# EAGLE schematic audio-pa-250mW-7.2V (EAGLE 5.07)
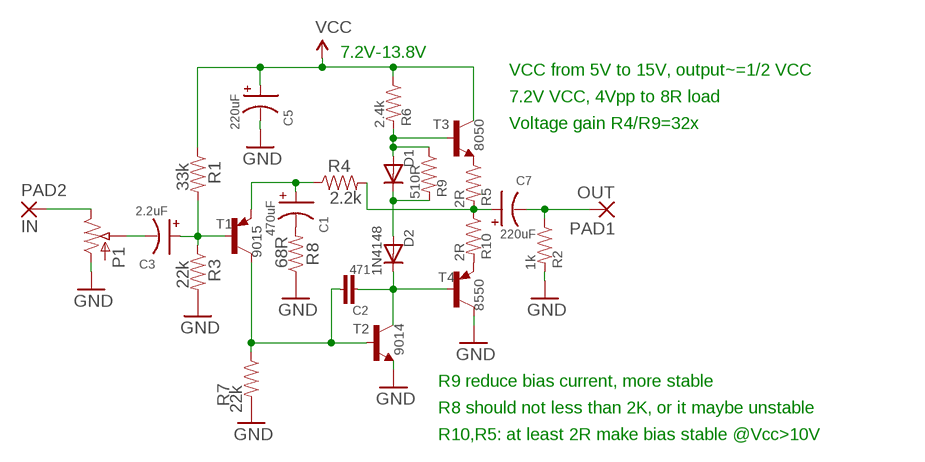
[diagram p0: schematic, sheet 1]

## Parts
C1  470uF  CAP_POLPTH1  [CPOL-RADIAL-100UF-25V]
C2  471  CAP-C0805  [C0805]
C3  2.2uF  CAP_POLPTH1  [CPOL-RADIAL-100UF-25V]
C5  220uF  CAP_POLPTH1  [CPOL-RADIAL-100UF-25V]
C7  220uF  CAP_POLPTH1  [CPOL-RADIAL-100UF-25V]
D1  DIODE1N4148  [DIODE-1N4148]
D2  1N4148  DIODE1N4148  [DIODE-1N4148]
P1  POTA16  [POTA_16]
PAD1  OUT  WIREPAD4,16O1,6  [4,16O1,6]
PAD2  IN  WIREPAD4,16O1,6  [4,16O1,6]
R1  33k  RESISTOR0805  [0805]
R2  1k  RESISTOR0805  [0805]
R3  22k  RESISTOR0805  [0805]
R4  2.2k  RESISTOR0805  [0805]
R5  2R  RESISTOR0805  [0805]
R6  2.4k  RESISTOR0805  [0805]
R7  22k  RESISTOR0805  [0805]
R8  68R  RESISTOR0805  [0805]
R9  510R  RESISTOR0805  [0805]
R10  2R  RESISTOR0805  [0805]
T1  9015  -PNP-TO92-EBC  [TO92-EBC]
T2  9014  -NPN-TO92-EBC  [TO92-EBC]
T3  8050  -NPN-TO92-EBC  [TO92-EBC]
T4  8550  -PNP-TO92-EBC  [TO92-EBC]

## Nets
GND: C5.2(-) P1.SCCW(A) R2.2 R3.2 R7.2 R8.1 T2.E T4.C
N$1: R10.2 T4.E
N$2: C1.2(-) R8.2
N$3: C2.2 D2.C T2.C T4.B
N$4: C3.1(+) R1.2 R3.1 T1.B
N$5: R5.1 T3.E
N$6: C1.1(+) R4.1 T1.E
N$7: D1.C D2.A R9.2
N$8: D1.A R6.2 R9.1 T3.B
N$9: C7.2(-) PAD1.1(P) R2.1
N$10: C2.1 R7.1 T1.C T2.B
N$11: P1.SCW(E) PAD2.1(P)
N$12: C3.2(-) P1.ROTOR(S)
N$13: C7.1(+) R4.2 R5.2 R10.1
VCC: C5.1(+) R1.1 R6.1 T3.C

## Notes on the sheet
- 7.2V-13.8V
- VCC from 5V to 15V, output~=1/2 VCC
- 7.2V VCC, 4Vpp to 8R load
- Voltage gain R4/R9=32x
- R9 reduce bias current, more stable
- R8 should not less than 2K, or it maybe unstable
- R10,R5: at least 2R make bias stable @Vcc>10V

## Library data of the parts
C1 C3 C5 C7 = digital-toy:CAP_POL: Capacitor Polarized These are standard SMD and PTH capacitors. Normally 10uF, 47uF, and 100uF in electrolytic and tantalum varieties. Always verify the external diameter of the through hole cap, it varies with capacity, voltage, and manufacturer. The EIA devices should be standard. PANASONIC_D size: 6.5mmx6.5mmx5.5mm, 100uf (taobao:6.3mmx5.5mm), same as CVL0605 153cvl0405 size: 4mmx4mmx5.5mm, 10uf (taobao:4mmx5.5mm) ct6032 typical 47uF Tantalum, comment by hyl.
C2 = digital-toy:CAP: Capacitor Standard 0603 ceramic capacitor, and 0.1" leaded capacitor.
D1 D2 = digital-toy:DIODE: Diode These are standard reverse protection diodes and small signal diodes. SMA package can handle up to about 1A. SOD-323 can handle about 200mA. What the SOD-323 package when ordering, there are some mfgs out there that are 5-pin packages.
P1 = digital-toy:POT: POT digital toy POT, 3296 multi turn, blue-white ... hyl 8/07/2001
PAD1 PAD2 = wirepad:WIREPAD: Wire PAD connect wire on PCB
R1-R10 = digital-toy:RESISTOR: Resistor Basic schematic elements and footprints for 0603, 1206, and PTH 1/10th watt (small) resistors. digital-toy copy vertical mount of axial-0.3 from rcl.lbr : the 0207/xx 3W resistor: 0617/17, 0617/22, 0617V
T1 T4 = digital-toy:*-PNP-: PNP Transistror
T2 T3 = digital-toy:*-NPN-: NPN Transistror most of sot-23 use the pacages sot23-BEC, top C, left B, right E. by hyl, digital-toy. and to-92 use ebc(from-top) by hyl, digital-toy.